# Altium schematic sheet QCopterFC_KEY_Sch.SchDoc
size A4
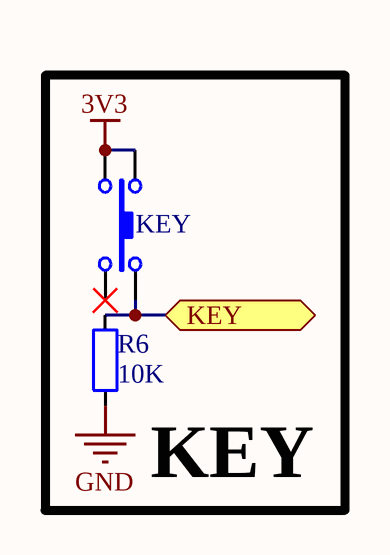
[diagram p0: QCopterFC_KEY_Sch.SchDoc]

## Parts
KEY  BT_TACT_3.5*5_90  [BT_TACT_3.5*3.55_90]  (value not drawn)
R6  value 10K  [RES_0603]  (hidden comment: Res_0603)

## Blocks framed on the sheet
KEY: KEY R6

## Ports
KEY

## Nets
3V3: KEY.1 KEY.3
GND: R6.1
KEY: KEY.2 R6.2 ; port KEY

Not connected (* = marked no-connect by the designer): KEY 4*

## Library data of the parts
KEY = BT_TACT_3.5*5_90: Switch
R6 = Res_0603: Resistor